# Altium schematic sheet SensWear_Debug_Pico.SchDoc (part 3 of 3)
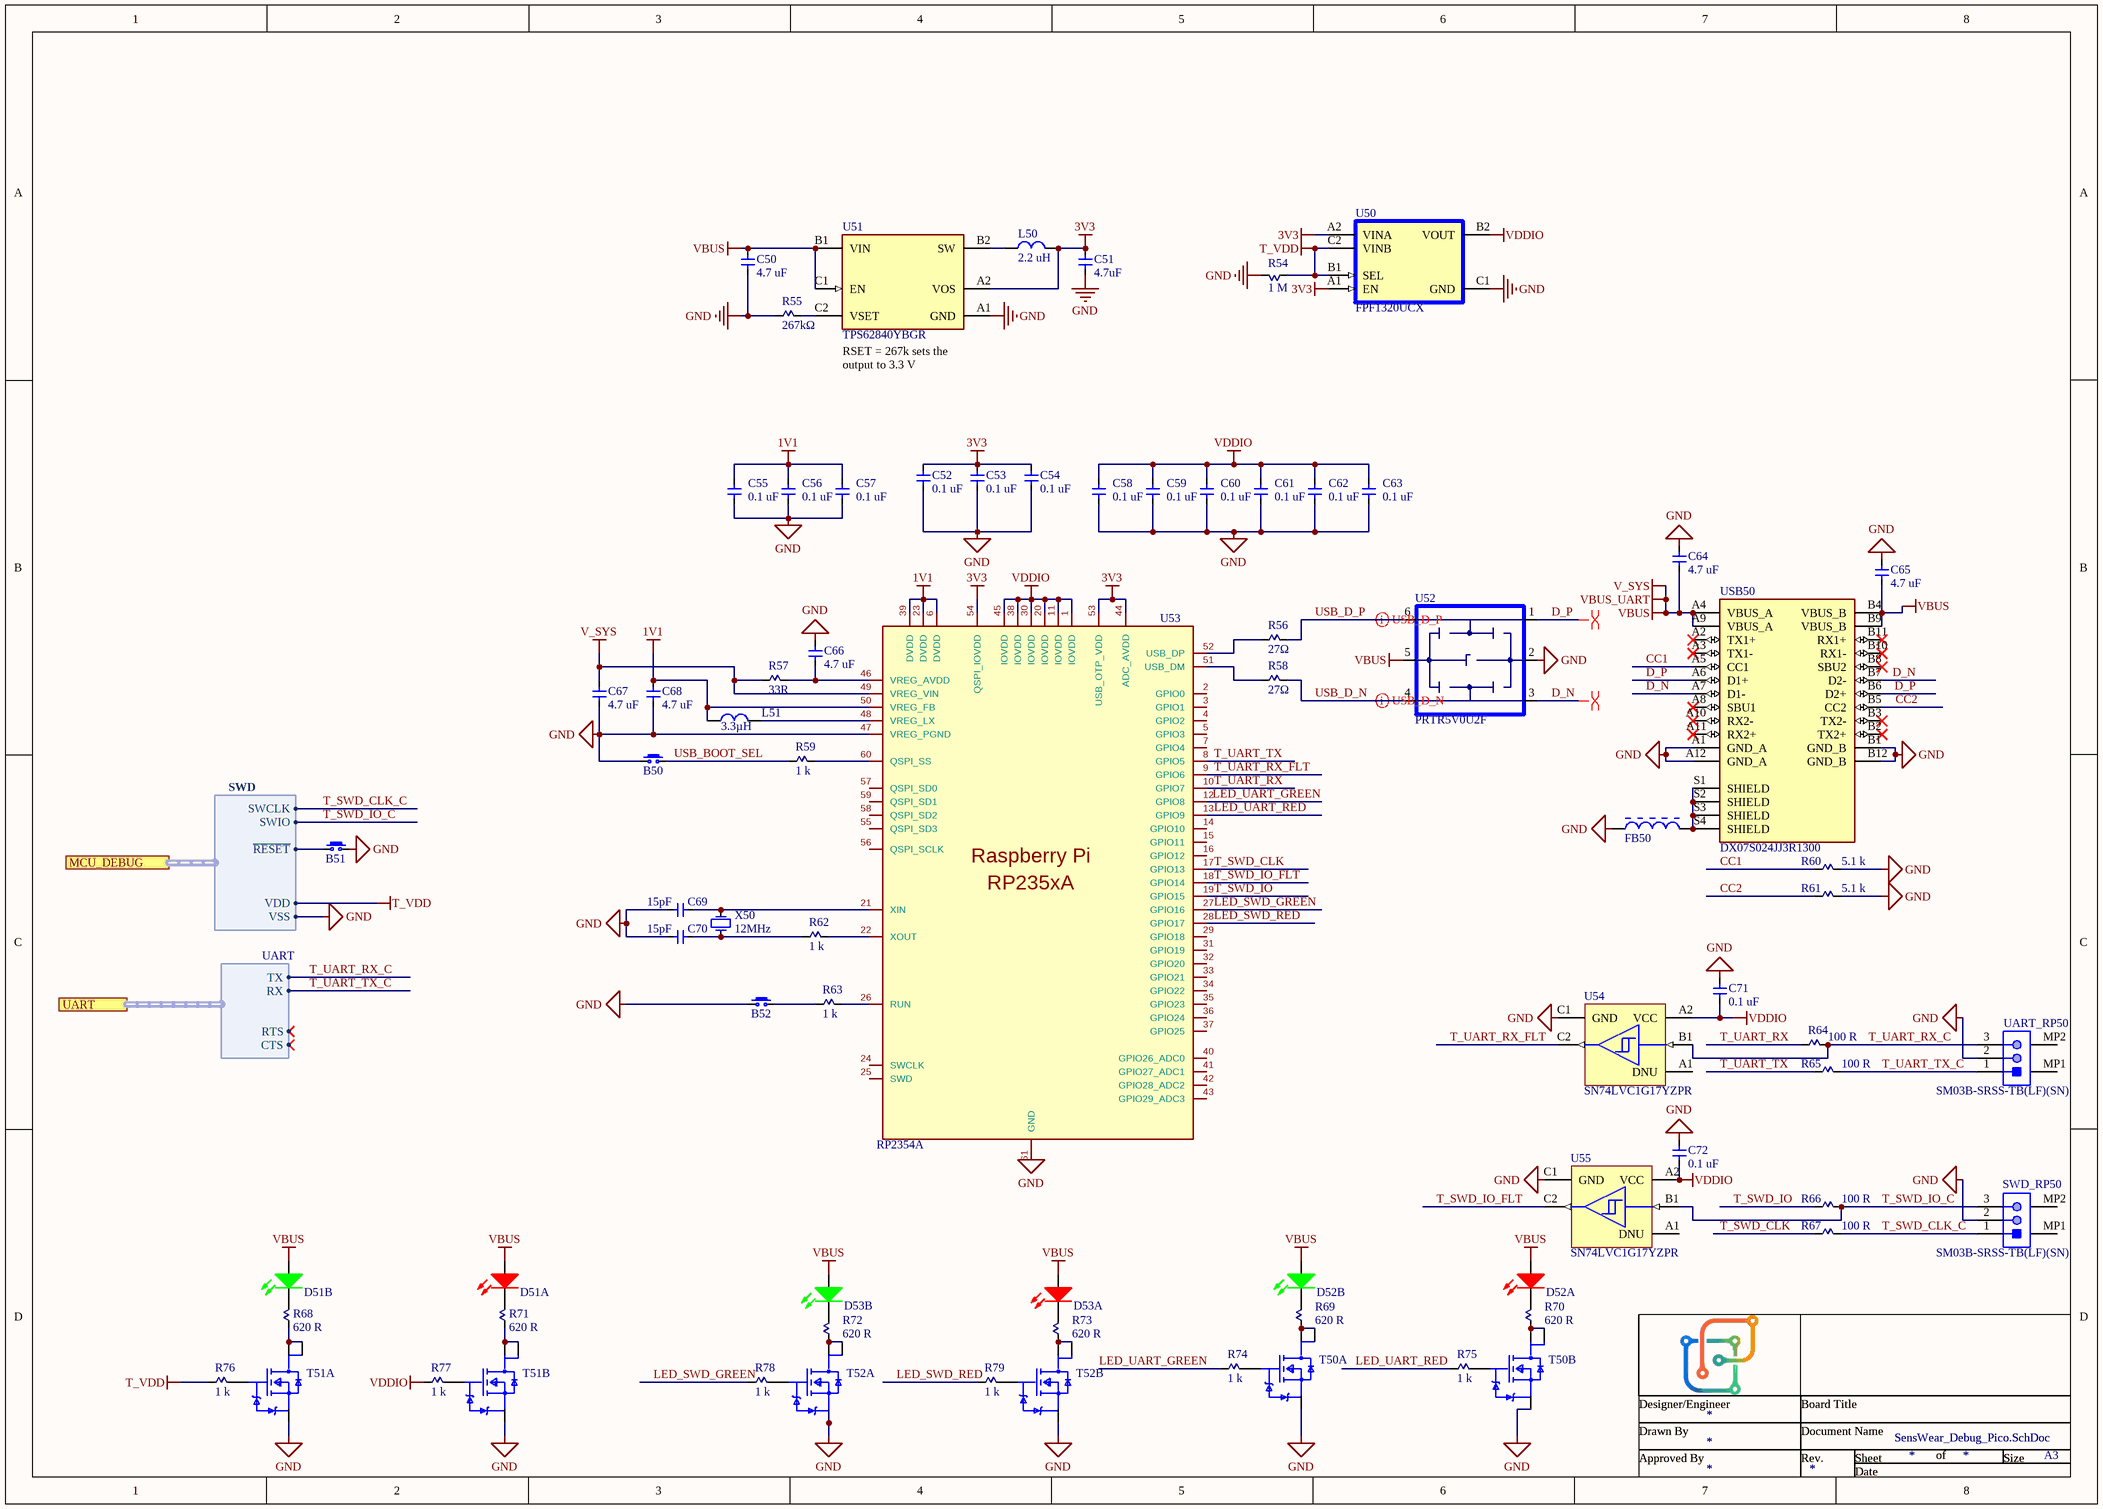
[diagram p2: SensWear_Debug_Pico.SchDoc]

## Library data of the parts (continued)
U52 = PRTR5V0U2F,115: TVS DIODE 5.5VWM SOT886; Manufacturer: NXP Semiconductors; Bidirectional Channels: 2; Voltage - Reverse Standoff (Typ): 5.5V (Max); Voltage - Breakdown (Min): 6V; Power Line Protection: Yes; Capacitance @ Frequency: 1pF @ 1MHz; Manufacturer Part Number: PRTR5V0U2F,115; RoHS: RoHS Compliant; Category: Circuit Protection; Stock 1: 51030; Pricing 1: 1=0.38, 10=0.325, 100=0.2427, 500=0.19058, 1000=0.14693 (GBP); Packaging: Digi-Reel®; Part Status: Active; Type: Steering (Rail to Rail); Unidirectional Channels: -; Voltage - Clamping (Max) @ Ipp: -; Current - Peak Pulse (10/1000µs): -; Power - Peak Pulse: -; Applications: Automotive; Operating Temperature: -40°C ~ 85°C (TA); Mounting Type: Surface Mount; Package / Case: 6-XFDFN; Supplier Device Package: 6-XSON, SOT886 (1.45x1); ComponentLink1URL: http://www.nxp.com/documents/data_sheet/PRTR5V0U2F_PRTR5V0U2K.pdf; ComponentLink1Description: http://www.nxp.com/documents/data_sheet/PRTR5V0U2F_PRTR5V0U2K.pdf; Supplier 1: DigiKey; Supplier Part Number 1: 568-4677-6-ND; Supplier 2: RS; Supplier Part Number 2: 8166931
U54 U55 = SN74LVC1G17YZPR: Schmitt Trigger 32mA 1 1.65V~5.5V 32mA 1 BGA-5 Buffer/Driver/Transceiver ROHS; Manufacturer: Texas Instruments; Manufacturer Lifecycle Status: ACTIVE; High Level Output Current: -32mA; Logic Function: Buffer, Schmitt Trigger; Max Supply Voltage: 5.5V; Min Supply Voltage: 1.65V; Number of Bits: 1; Polarity: Non-Inverting; Propagation Delay: 5ns; Quiescent Current: 1.5µA; Operating Supply Voltage: 3.3V; Supplier: DigiKey; Supplier Part Number: 296-SN74LVC1G17YZPRCT-ND; Manufacturer Part Number: SN74LVC1G17YZPR; RoHS: Compliant; Category: Buffers, Drivers and Transceivers; Stock: 4124; Pricing: 1=0.46, 10=0.325, 25=0.29, 100=0.2515, 250=0.2332, 500=0.22216, 1000=0.21307 (USD); Case/Package: BGA; Contact Plating: Copper, Silver, Tin; Height: 500µm; Lead Free: Lead Free; Length: 1.75mm; Lifecycle Status: Production; Low Level Output Current: 32mA; Max Operating Temperature: 125°C; Min Operating Temperature: -40°C; Mounting Technology: Surface Mount; Number of Bits per Element: 1; Number of Channels: 1; Number of Elements: 1; Number of Gates: 1; Number of Input Lines: 1; Number of Inputs: 1; Number of Output Lines: 1; Number of Outputs: 1; Pins: 5; Packaging: Cut Tape; Radiation Hardening: No; REACH SVHC: No; Termination: SMD/SMT; Thickness: 310µm; Turn-On Delay Time: 5ns; Width: 1.25mm; ComponentLink1URL: https://sigma.octopart.com:443/82288934/technical_drawing/Texas-Instruments-SN74LVC1G17YZPR.pdf?src-supplier=Texas+Instruments; ComponentLink1Description: https://sigma.octopart.com:443/82288934/technical_drawing/Texas-Instruments-SN74LVC1G17YZPR.pdf?src-supplier=Texas+Instruments; ComponentLink2URL: https://octopart.com:443/opatz8j6/c1?t=PyRarBsQ05LdiDhXNvU2f3oOqG1-bb7WCxWCMaxFTmsOtBRs7KjqXNp5sK_2d0llqty9KOIOP86L9m9F78mSvRKYKo43feLMx4OdbDLm-cZoL3aN5xX_-495hjOu7brVzsSaJqe0eM_P8AhVpHi5puBlhKbIrFeSrOCwHxcHWgi5PnhRUKZWtBRbK-25zEuCk6Jfi-bdFYgzu2MWub_x0O3lvfea8XTq7PdaVle1BtMyJ7Nv0Q4WJJSTRfTQuvPxk3b1_s4PYKQPF9FomEyeEEj8XMVdl7f4NPzizzEWK0FpT5uVNEEH98wbQrCFEjl8Ci9lfXN94WXBbZAYDLWqKcgI-0_yVWRTKmhI7HVloxJ-RsHHV951LAIPonwWLS7kB55M7FxHmQ&src-supplier=Texas+Instruments; ComponentLink2Description: https://octopart.com:443/opatz8j6/c1?t=PyRarBsQ05LdiDhXNvU2f3oOqG1-bb7WCxWCMaxFTmsOtBRs7KjqXNp5sK_2d0llqty9KOIOP86L9m9F78mSvRKYKo43feLMx4OdbDLm-cZoL3aN5xX_-495hjOu7brVzsSaJqe0eM_P8AhVpHi5puBlhKbIrFeSrOCwHxcHWgi5PnhRUKZWtBRbK-25zEuCk6Jfi-bdFYgzu2MWub_x0O3lvfea8XTq7PdaVle1BtMyJ7Nv0Q4WJJSTRfTQuvPxk3b1_s4PYKQPF9FomEyeEEj8XMVdl7f4NPzizzEWK0FpT5uVNEEH98wbQrCFEjl8Ci9lfXN94WXBbZAYDLWqKcgI-0_yVWRTKmhI7HVloxJ-RsHHV951LAIPonwWLS7kB55M7FxHmQ&src-supplier=Texas+Instruments; ComponentLink3URL: https://datasheet.octopart.com:443/SN74LVC1G17YZPR-Texas-Instruments-datasheet-25356049.pdf?src-supplier=Texas+Instruments; ComponentLink3Description: https://datasheet.octopart.com:443/SN74LVC1G17YZPR-Texas-Instruments-datasheet-25356049.pdf?src-supplier=Texas+Instruments; ComponentLink4URL: https://sigma.octopart.com:443/49258429/technical_drawing/Texas-Instruments-SN74LVC1G17YZPR.pdf?src-supplier=Texas+Instruments; ComponentLink4Description: https://sigma.octopart.com:443/49258429/technical_drawing/Texas-Instruments-SN74LVC1G17YZPR.pdf?src-supplier=Texas+Instruments; ComponentLink5URL: https://datasheet.octopart.com:443/SN74LVC1G17YZPR-Texas-Instruments-datasheet-13037214.pdf?src-supplier=Texas+Instruments; ComponentLink5Description: https://datasheet.octopart.com:443/SN74LVC1G17YZPR-Texas-Instruments-datasheet-13037214.pdf?src-supplier=Texas+Instruments; ComponentLink6URL: https://datasheet.octopart.com:443/SN74LVC1G17YZPR-Texas-Instruments-datasheet-10899358.pdf?src-supplier=Texas+Instruments; ComponentLink6Description: https://datasheet.octopart.com:443/SN74LVC1G17YZPR-Texas-Instruments-datasheet-10899358.pdf?src-supplier=Texas+Instruments; ComponentLink7URL: https://datasheet.octopart.com:443/SN74LVC1G17YZPR-Texas-Instruments-datasheet-10669839.pdf?src-supplier=Texas+Instruments; ComponentLink7Description: https://datasheet.octopart.com:443/SN74LVC1G17YZPR-Texas-Instruments-datasheet-10669839.pdf?src-supplier=Texas+Instruments; ComponentLink8URL: https://datasheet.octopart.com:443/SN74LVC1G17YZPR-Texas-Instruments-datasheet-152405.pdf?src-supplier=Texas+Instruments; ComponentLink8Description: https://datasheet.octopart.com:443/SN74LVC1G17YZPR-Texas-Instruments-datasheet-152405.pdf?src-supplier=Texas+Instruments; ComponentLink9URL: https://datasheet.octopart.com:443/SN74LVC1G17YZPR-Texas-Instruments-datasheet-151447.pdf?src-supplier=Texas+Instruments; ComponentLink9Description: https://datasheet.octopart.com:443/SN74LVC1G17YZPR-Texas-Instruments-datasheet-151447.pdf?src-supplier=Texas+Instruments; ComponentLink10URL: https://datasheet.octopart.com:443/SN74LVC1G17YZPR-Texas-Instruments-datasheet-10256894.pdf?src-supplier=Texas+Instruments; ComponentLink10Description: https://datasheet.octopart.com:443/SN74LVC1G17YZPR-Texas-Instruments-datasheet-10256894.pdf?src-supplier=Texas+Instruments; ComponentLink11URL: https://datasheet.octopart.com:443/SN74LVC1G17YZPR-Texas-Instruments-datasheet-21221582.pdf?src-supplier=HQonline; ComponentLink11Description: https://datasheet.octopart.com:443/SN74LVC1G17YZPR-Texas-Instruments-datasheet-21221582.pdf?src-supplier=HQonline; ComponentLink12URL: https://datasheet.octopart.com:443/SN74LVC1G17YZPR-Texas-Instruments-datasheet-164417656.pdf?src-supplier=SHENGYU+ELECTRONICS; ComponentLink12Description: https://datasheet.octopart.com:443/SN74LVC1G17YZPR-Texas-Instruments-datasheet-164417656.pdf?src-supplier=SHENGYU+ELECTRONICS; ComponentLink13URL: https://datasheet.octopart.com:443/SN74LVC1G17YZPR-Texas-Instruments-datasheet-65713482.pdf?src-supplier=Newark; ComponentLink13Description: https://datasheet.octopart.com:443/SN74LVC1G17YZPR-Texas-Instruments-datasheet-65713482.pdf?src-supplier=Newark; ComponentLink14URL: https://datasheet.octopart.com:443/SN74LVC1G17YZPR-Texas-Instruments-datasheet-62342808.pdf?src-supplier=Newark; ComponentLink14Description: https://datasheet.octopart.com:443/SN74LVC1G17YZPR-Texas-Instruments-datasheet-62342808.pdf?src-supplier=Newark; ComponentLink15URL: https://datasheet.octopart.com:443/SN74LVC1G17YZPR-Texas-Instruments-datasheet-14144602.pdf?src-supplier=iiiC; ComponentLink15Description: https://datasheet.octopart.com:443/SN74LVC1G17YZPR-Texas-Instruments-datasheet-14144602.pdf?src-supplier=iiiC; ComponentLink16URL: https://datasheet.octopart.com:443/SN74LVC1G17YZPR-Texas-Instruments-datasheet-11534093.pdf?src-supplier=Farnell; ComponentLink16Description: https://datasheet.octopart.com:443/SN74LVC1G17YZPR-Texas-Instruments-datasheet-11534093.pdf?src-supplier=Farnell; ComponentLink17URL: https://datasheet.octopart.com:443/SN74LVC1G17YZPR-Texas-Instruments-datasheet-10413188.pdf?src-supplier=Farnell; ComponentLink17Description: https://datasheet.octopart.com:443/SN74LVC1G17YZPR-Texas-Instruments-datasheet-10413188.pdf?src-supplier=Farnell; ComponentLink18URL: https://datasheet.octopart.com:443/SN74LVC1G17YZPR-Texas-Instruments-datasheet-530134.pdf?src-supplier=Farnell; ComponentLink18Description: https://datasheet.octopart.com:443/SN74LVC1G17YZPR-Texas-Instruments-datasheet-530134.pdf?src-supplier=Farnell; ComponentLink19URL: https://datasheet.octopart.com:443/SN74LVC1G17YZPR-Texas-Instruments-datasheet-24634.pdf?src-supplier=DigiKey; ComponentLink19Description: https://datasheet.octopart.com:443/SN74LVC1G17YZPR-Texas-Instruments-datasheet-24634.pdf?src-supplier=DigiKey; ComponentLink20URL: http://sigma.octopart.com:80/reach_statement/Texas-Instruments-company-64.pdf?src-supplier=Compliance+Statements; ComponentLink20Description: http://sigma.octopart.com:80/reach_statement/Texas-Instruments-company-64.pdf?src-supplier=Compliance+Statements; ComponentLink21URL: http://sigma.octopart.com:80/conflict_mineral_statement/Texas-Instruments-company-63.pdf?src-supplier=Compliance+Statements; ComponentLink21Description: http://sigma.octopart.com:80/conflict_mineral_statement/Texas-Instruments-company-63.pdf?src-supplier=Compliance+Statements; Supplier 1: DigiKey; Supplier Part Number 1: 296-SN74LVC1G17YZPRCT-ND
USB50 = DX07S024JJ3R1300: Cut Tape - Usb Type C Receptacle Mid Mnt Dual R; Manufacturer: JAE Electronics; Number of Contacts: 24; Number of Ports: 1; Voltage Rating: 20V; Mating Cycles: 10000; Shielding: Shielded; Current Rating: 5A; Manufacturer Part Number: DX07S024JJ3R1300; RoHS: Yes; Category: USB Connectors; Stock: 21875; Pricing: 1=1.78, 10=1.612, 25=1.5272, 50=1.4916, 100=1.4205, 250=1.25048 (USD); Mounting Technology: Surface Mount,Through Hole,Horizontal; Contact Plating: Gold; Insulation Color: Black; Contact Material: 153,157ConductorMaterial; Min Operating Temperature: -30°C; Max Operating Temperature: 80°C; Packaging: Cut Tape; Connector Type: USB; Gender: Receptacle; Series: DX07; Termination: Solder; Height: 3.29mm; RoHS Compliant: Yes; ComponentLink1URL: http://www.alliedelec.com/m/d/e03b7b5d71e2d3e369c52d5c8eaca2b6.pdf?src-supplier=Allied+Electronics; ComponentLink1Description: http://www.alliedelec.com/m/d/e03b7b5d71e2d3e369c52d5c8eaca2b6.pdf?src-supplier=Allied+Electronics; ComponentLink2URL: http://www.jae.com/z-en/pdf_download_exec.cfm?param=SJ115995.pdf&src-supplier=Digikey; ComponentLink2Description: http://www.jae.com/z-en/pdf_download_exec.cfm?param=SJ115995.pdf&src-supplier=Digikey; Supplier 1: Mouser; Supplier Part Number 1: 656-DX07S024JJ3R1300; Supplier 2: Digikey; Supplier Part Number 2: 670-2846-1-ND
X50 = ABM8-272-T3: Parallel - Fundamental Quartz Crystal, 12MHz Nom; Manufacturer: Abracon; Frequency Stability: 30ppm; Frequency Tolerance: 0.003%; Load Capacitance: 10pF; ESR: 50Ω; Supplier: DigiKey; Supplier Part Number: 535-ABM8-272-T3CT-ND; Manufacturer Part Number: ABM8-272-T3; RoHS: Compliant; Category: Crystals; Stock: 2593; Pricing: 1=0.54, 10=0.47, 25=0.4444, 50=0.4262, 100=0.4085, 250=0.38632, 500=0.37032, 1000=0.355 (USD); Frequency: 12MHz; Harmonized Tariff Schedule (HTS) Code: 8541.60.00.80; Introduction Date: 2024-01-22; Lifecycle Status: Production; Max Operating Temperature: 85°C; Min Operating Temperature: -40°C; Mounting Technology: Surface Mount; REACH SVHC: Yes; ComponentLink1URL: https://datasheet.octopart.com:443/ABM8-272-T3-Abracon-datasheet-103059652.pdf?src-supplier=Electro+Sonic; ComponentLink1Description: https://datasheet.octopart.com:443/ABM8-272-T3-Abracon-datasheet-103059652.pdf?src-supplier=Electro+Sonic; ComponentLink2URL: http://sigma.octopart.com:80/conflict_mineral_statement/Abracon-company-27.pdf?src-supplier=Compliance+Statements; ComponentLink2Description: http://sigma.octopart.com:80/conflict_mineral_statement/Abracon-company-27.pdf?src-supplier=Compliance+Statements; Supplier 1: DigiKey; Supplier Part Number 1: 535-ABM8-272-T3CT-ND